# Altium schematic sheet Power_supplies.SchDoc
size A3; SheetNumber: 2; SheetTotal: 11
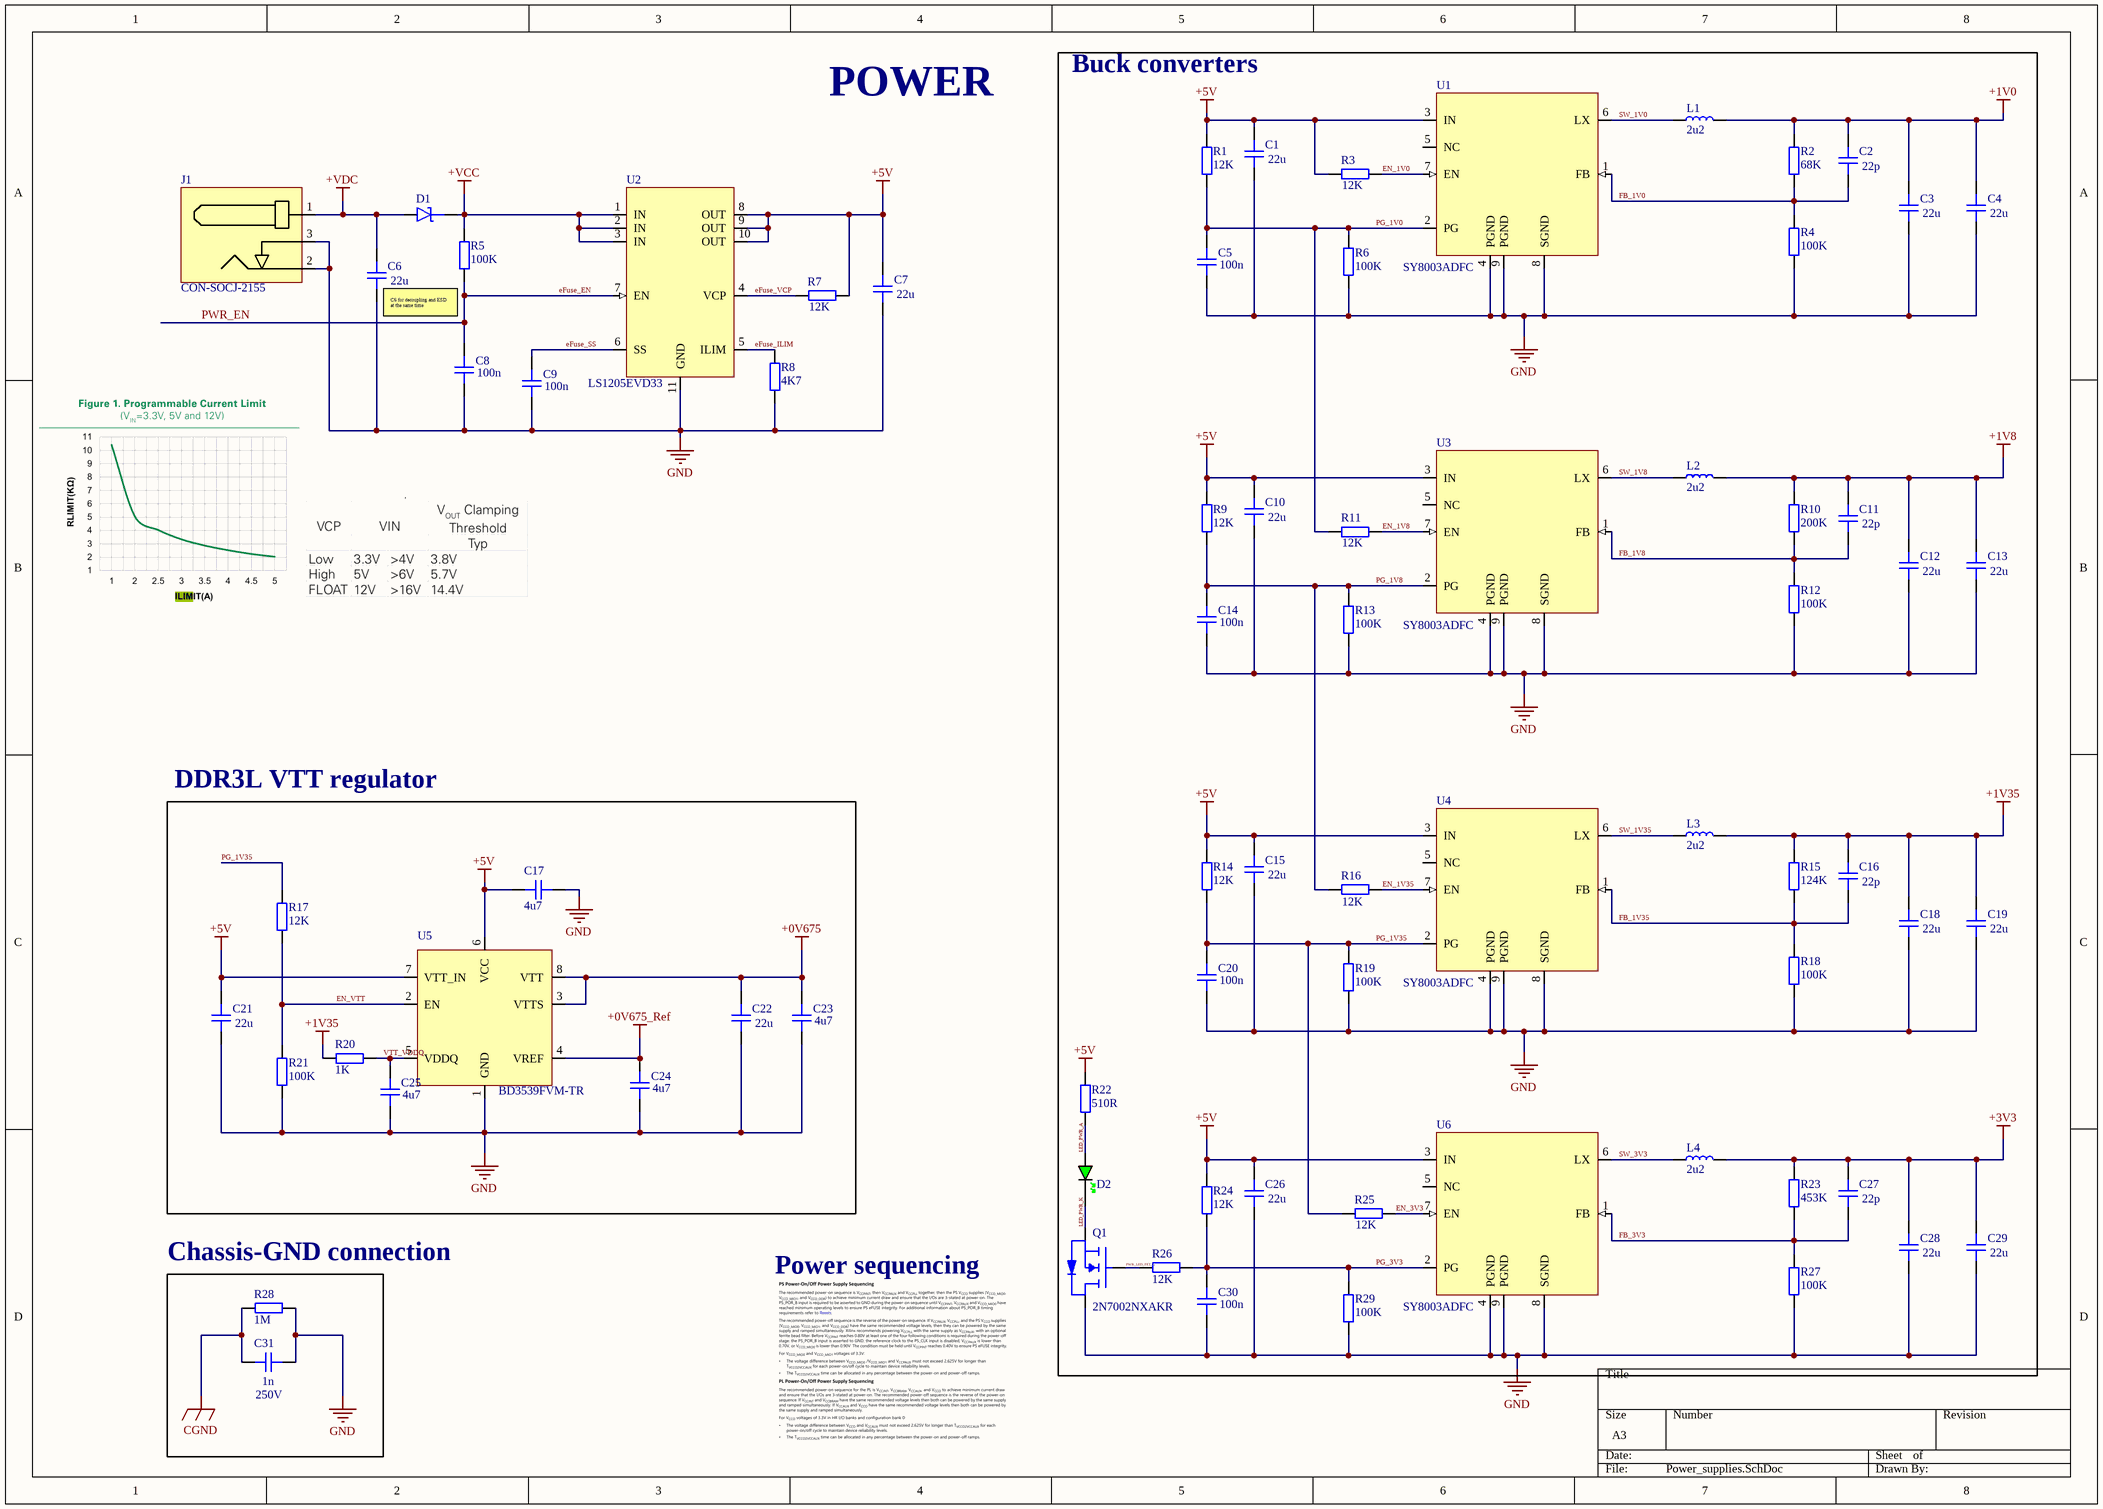
[diagram p0: Power_supplies.SchDoc]

## Parts
C1  value 22u  [CAP_1210]  (hidden comment: C1210)
C2  value 22p  [CAP_0402]  (hidden comment: C0402)
C3  value 22u  [CAP_1210]  (hidden comment: C1210)
C4  value 22u  [CAP_1210]  (hidden comment: C1210)
C5  value 100n  [CAP_0402]  (hidden comment: C0402)
C6  value 22u  [CAP_1210]  (hidden comment: C1210)
C7  value 22u  [CAP_1210]  (hidden comment: C1210)
C8  value 100n  [CAP_0402]  (hidden comment: C0402)
C9  value 100n  [CAP_0402]  (hidden comment: C0402)
C10  value 22u  [CAP_1210]  (hidden comment: C1210)
C11  value 22p  [CAP_0402]  (hidden comment: C0402)
C12  value 22u  [CAP_1210]  (hidden comment: C1210)
C13  value 22u  [CAP_1210]  (hidden comment: C1210)
C14  value 100n  [CAP_0402]  (hidden comment: C0402)
C15  value 22u  [CAP_1210]  (hidden comment: C1210)
C16  value 22p  [CAP_0402]  (hidden comment: C0402)
C17  value 4u7  [CAP_0402]  (hidden comment: C0402)
C18  value 22u  [CAP_1210]  (hidden comment: C1210)
C19  value 22u  [CAP_1210]  (hidden comment: C1210)
C20  value 100n  [CAP_0402]  (hidden comment: C0402)
C21  value 22u  [CAP_1210]  (hidden comment: C1210)
C22  value 22u  [CAP_1210]  (hidden comment: C1210)
C23  value 4u7  [CAP_0402]  (hidden comment: C0402)
C24  value 4u7  [CAP_0402]  (hidden comment: C0402)
C25  value 4u7  [CAP_0402]  (hidden comment: C0402)
C26  value 22u  [CAP_1210]  (hidden comment: C1210)
C27  value 22p  [CAP_0402]  (hidden comment: C0402)
C28  value 22u  [CAP_1210]  (hidden comment: C1210)
C29  value 22u  [CAP_1210]  (hidden comment: C1210)
C30  value 100n  [CAP_0402]  (hidden comment: C0402)
C31  value 1n  Voltage: 250V  [CAP_1206]  (hidden comment: C1206)
D1  D_SCHOTTKY_SOD_323  [SOD-323]  (value not drawn)
D2  GREEN  [LED_0402_GREEN]  (value not drawn)
J1  CON-SOCJ-2155  [CON-SOCJ-2155]
L1  2u2  [SRP0415]
L2  2u2  [SRP0415]
L3  2u2  [SRP0415]
L4  2u2  [SRP0415]
Q1  2N7002NXAKR  [SSM3J338R,LF-SOT23-F]
R1  value 12K  [RES_0402]  (hidden comment: R0402)
R2  value 68K  [RES_0402]  (hidden comment: R0402)
R3  value 12K  [RES_0402]  (hidden comment: R0402)
R4  value 100K  [RES_0402]  (hidden comment: R0402)
R5  value 100K  [RES_0402]  (hidden comment: R0402)
R6  value 100K  [RES_0402]  (hidden comment: R0402)
R7  value 12K  [RES_0402]  (hidden comment: R0402)
R8  value 4K7  [RES_0402]  (hidden comment: R0402)
R9  value 12K  [RES_0402]  (hidden comment: R0402)
R10  value 200K  [RES_0402]  (hidden comment: R0402)
R11  value 12K  [RES_0402]  (hidden comment: R0402)
R12  value 100K  [RES_0402]  (hidden comment: R0402)
R13  value 100K  [RES_0402]  (hidden comment: R0402)
R14  value 12K  [RES_0402]  (hidden comment: R0402)
R15  value 124K  [RES_0402]  (hidden comment: R0402)
R16  value 12K  [RES_0402]  (hidden comment: R0402)
R17  value 12K  [RES_0402]  (hidden comment: R0402)
R18  value 100K  [RES_0402]  (hidden comment: R0402)
R19  value 100K  [RES_0402]  (hidden comment: R0402)
R20  value 1K  [RES_0402]  (hidden comment: R0402)
R21  value 100K  [RES_0402]  (hidden comment: R0402)
R22  value 510R  [RES_0402]  (hidden comment: R0402)
R23  value 453K  [RES_0402]  (hidden comment: R0402)
R24  value 12K  [RES_0402]  (hidden comment: R0402)
R25  value 12K  [RES_0402]  (hidden comment: R0402)
R26  value 12K  [RES_0402]  (hidden comment: R0402)
R27  value 100K  [RES_0402]  (hidden comment: R0402)
R28  1M  [RES_1206]
R29  value 100K  [RES_0402]  (hidden comment: R0402)
U1  SY8003ADFC  [DFN2x2-8]
U2  LS1205EVD33  [DFN3x3_10L]
U3  SY8003ADFC  [DFN2x2-8]
U4  SY8003ADFC  [DFN2x2-8]
U5  BD3539FVM-TR  [MSOP8]
U6  SY8003ADFC  [DFN2x2-8]

## Blocks framed on the sheet
Buck converters: C1-C5 C10-C16 C18-C20 C26-C30 D2 L1-L4 Q1 R1-R4 R6 R9-R16 R18 R19 R22-R27 R29 U1 U3 U4 U6
DDR3L VTT regulator: C17 C21-C25 R17 R20 R21 U5
Chassis-GND connection: C31 R28

## Nets
+0V675: C22.2 C23.2 U5.3(VTTS) U5.8(VTT)
+0V675_Ref: C24.2 U5.4(VREF)
+1V0: C2.2 C3.2 C4.2 L1.2 R2.2
+1V8: C11.2 C12.2 C13.2 L2.2 R10.2
+1V35: C16.2 C18.2 C19.2 L3.2 R15.2 R20.2
+3V3: C27.2 C28.2 C29.2 L4.2 R23.2
+5V: C1.2 C7.2 C10.2 C15.2 C17.2 C21.2 C26.2 R1.2 R3.1 R7.2 R9.2 R14.2 R22.2 R24.2 U1.3(IN) U2.8(OUT) U2.9(OUT) U2.10(OUT) U3.3(IN) U4.3(IN) U5.6(VCC) U5.7(VTT_IN) U6.3(IN)
+VCC: D1.K R5.2 U2.1(IN) U2.2(IN) U2.3(IN)
+VDC: C6.2 D1.A J1.1
CGND: C31.1 R28.1
GND: C1.1 C3.1 C4.1 C5.1 C6.1 C7.1 C8.1 C9.1 C10.1 C12.1 C13.1 C14.1 C15.1 C17.1 C18.1 C19.1 C20.1 C21.1 C22.1 C23.1 C24.1 C25.1 C26.1 C28.1 C29.1 C30.1 C31.2 J1.2 J1.3 Q1.D R4.1 R6.1 R8.1 R12.1 R13.1 R18.1 R19.1 R21.1 R27.1 R28.2 R29.1 U1.4(PGND) U1.8(SGND) U1.9(PGND) U2.11(GND) U3.4(PGND) U3.8(SGND) U3.9(PGND) U4.4(PGND) U4.8(SGND) U4.9(PGND) U5.1(GND) U6.4(PGND) U6.8(SGND) U6.9(PGND)
eFuse_EN: C8.2 R5.1 U2.7(EN)  [also labelled PWR_EN]
eFuse_ILIM: R8.2 U2.5(ILIM)
eFuse_SS: C9.2 U2.6(SS)
eFuse_VCP: R7.1 U2.4(VCP)
EN_1V0: R3.2 U1.7(EN)
EN_1V8: R11.2 U3.7(EN)
EN_1V35: R16.2 U4.7(EN)
EN_3V3: R25.2 U6.7(EN)
EN_VTT: R17.1 R21.2 U5.2(EN)
FB_1V0: C2.1 R2.1 R4.2 U1.1(FB)
FB_1V8: C11.1 R10.1 R12.2 U3.1(FB)
FB_1V35: C16.1 R15.1 R18.2 U4.1(FB)
FB_3V3: C27.1 R23.1 R27.2 U6.1(FB)
LED_PWR_A: D2.A R22.1
LED_PWR_K: D2.K Q1.S
PG_1V0: C5.2 R1.1 R6.2 R11.1 U1.2(PG)
PG_1V8: C14.2 R9.1 R13.2 R16.1 U3.2(PG)
PG_1V35: C20.2 R14.1 R17.2 R19.2 R25.1 U4.2(PG)
PG_3V3: C30.2 R24.1 R26.1 R29.2 U6.2(PG)
PWR_LED_FET_G: Q1.G R26.2
SW_1V0: L1.1 U1.6(LX)
SW_1V8: L2.1 U3.6(LX)
SW_1V35: L3.1 U4.6(LX)
SW_3V3: L4.1 U6.6(LX)
VTT_VDDQ: C25.2 R20.1 U5.5(VDDQ)

Not connected (* = marked no-connect by the designer): U1 5(NC); U3 5(NC); U4 5(NC); U6 5(NC)

## Notes on the sheet
- POWER
- (near C6) C6 for decoupling and ESD at the same time
- Power sequencing

## Library data of the parts
C1 C3 C4 C6 C7 C10 C12 C13 C15 C18 C19 C21 C22 C26 C28 C29 = CAP_1210: Capacitor SMD 1210; Manufacturer: *; Manufacturer Part Number: *; Distributor Link: *; LCSC: *; Rating: *; Dielectric: *
C2 C5 C8 C9 C11 C14 C16 C17 C20 C23-C25 C27 C30 = CAP_0402: Capacitor SMD 0402; Manufacturer: *; Manufacturer Part Number: *; Distributor Link: *; LCSC: *; Rating: *; Dielectric: *
C31 = CAP_1206: Capacitor SMD 1206; Manufacturer: *; Manufacturer Part Number: *; Distributor Link: *; LCSC: *; Rating: *; Dielectric: *
D1 = D_SCHOTTKY_SOD_323: Diode Schottky SMD SOD-323
D2 = LED_0402_GREEN: LED 0402 GREEN SMD
J1 = CON-SOCJ-2155: DC Barrell Jack 2.1mm 30V 2.5A THT; Manufacturer: Gravitech; Manufacturer Part Number: CON-SOCJ-2155
L1-L4 = SRP0415-2R2K: Inductor SMD 2.2uH Bourns SRP0415-2R2K; Manufacturer: Bourns; Manufacturer Part Number: SRP0415-2R2K
Q1 = 2N7002NXAKR: MOSFET N-Channel Vds=60V Id=300mA with ESD Protection; Manufacturer: Nexperia; Manufacturer Part Number: 2N7002NXAKR
R1-R27 R29 = RES_0402: Resistor SMD 0402; Manufacturer: *; Manufacturer Part Number: *; Distributor Link: *; LCSC: *
R28 = RES_1206: Resistor SMD 1206; Manufacturer: *; Manufacturer Part Number: *; Distributor Link: *; LCSC: *
U1 U3 U4 U6 = SY8003ADFC: High Efficiency 5.5V, 3A Continuous, 1MHz Synchronous Step Down Regulator; Manufacturer: Silergy; Manufacturer Part Number: High Efficiency 5.5V, 3A continuous, 1MHz; LCSC: C178236
U2 = LS1205EVD33: 18V, 5A eFuse with Programmable Current Limit and Output Voltage Clamp; Manufacturer: Littelfuse; Manufacturer Part Number: LS1205EVD33
U5 = BD3539FVM-TR: 1.0V to 5.5V, 1A 1Ch Termination Regulator for DDR-SDRAMs; Manufacturer: ROHM Semiconductor; Manufacturer Part Number: BD3539FVM-TR